# Altium project LDR_Sensor.PrjPcb
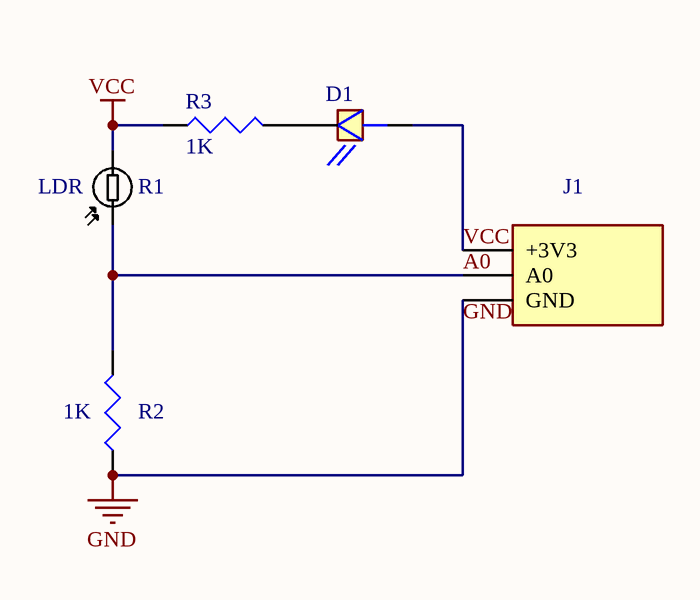
[diagram p0: LDR_Sensor_SCH.SchDoc]
1 sheet, 5 parts. Net scope: global (net labels, ports and power ports of the same name join across sheets).
Board file: LDR_PCB.PcbDoc

## Sheet LDR_Sensor_SCH.SchDoc
size A; SheetNumber: 1; SheetTotal: 1

### Parts
D1  OVLAW4CB7  [LEDRD254W50D305H520P]  (value not drawn)
J1  MTSW-103-07-G-S-140  [PBC03SAAN]  (value not drawn)
R1  LDR  [PDV-P8104]
R2  1K  [CF14JT1K00]
R3  1K  [CF14JT1K00]

### Nets
GND: J1.03(GND) R2.1
VCC: D1.A J1.VCC(+3V3) R1.1 R3.1
A0: J1.02(A0) R1.2 R2.2
NetD1_C: D1.C R3.2

### Library data of the parts
D1 = OVLAW4CB7: Ovlaw4Cb7 White LED 3mm (T-1) Round Lens Through Hole Package | Optek (TT Electronics) OVLAW4CB7; MF: TT Electronics/Optek; SnapEDA_Link: https://www.snapeda.com/parts/OVLAW4CB7/TT+Electronics%252FOptek/view-part/?ref=snap; Package: Package; Value: *; MP: OVLAW4CB7; Check_prices: https://www.snapeda.com/parts/OVLAW4CB7/TT+Electronics%252FOptek/view-part/?ref=eda
R1 = PDV-P8104: CDS PHOTORESISTOR 5MM; Manufacturer: Advanced Photonix; Wavelength: 520nm; Rise Time: 60ms; Value: -60000R; Supplier: Digikey; Supplier Part Number: PDV-P8104-ND; Manufacturer Part Number: PDV-P8104; RoHS: No; Category: Optical Sensors; Stock: 5792; Pricing: 1=0.87, 5=0.762, 10=0.724, 25=0.6772, 50=0.6454, 100=0.6164, 500=0.55816, 1000=0.53652, 5000=0.49297 (USD); Case/Package: Radial; Housing Material: Ceramic; Min Operating Temperature: -30°C; Max Operating Temperature: 75°C; Packaging: Bag; Series: -; Diameter: 5.1mm; Height: 2mm; Lead Free: Lead Free; ComponentLink1URL: https://datasheet.ciiva.com/2819/pdv-p8104-2819548.pdf?src-supplier=Digikey; ComponentLink1Description: https://datasheet.ciiva.com/2819/pdv-p8104-2819548.pdf?src-supplier=Digikey
R2 R3 = CF14JT1K00: RES 1K OHM 5% 1/4W AXIAL; Manufacturer: Stackpole Electronics; Supplier: Digikey; Supplier Part Number: CF14JT1K00CT-ND; Manufacturer Part Number: CF14JT1K00; RoHS: Yes; Category: Through-Hole Resistors; Stock: 677085; Pricing: 1=0.1, 10=0.026, 25=0.022, 50=0.0192, 100=0.0169, 250=0.01424, 500=0.0126, 1000=0.0112 (USD); ComponentLink1URL: http://components.arrow.com/part/dataview/27620077S9848643N1174?src-supplier=Arrow+Electronics; ComponentLink1Description: http://components.arrow.com/part/dataview/27620077S9848643N1174?src-supplier=Arrow+Electronics; ComponentLink2URL: https://www.seielect.com/catalog/SEI-CF_CFM.pdf?src-supplier=Avnet; ComponentLink2Description: https://www.seielect.com/catalog/SEI-CF_CFM.pdf?src-supplier=Avnet; ComponentLink3URL: https://www.seielect.com/catalog/SEI-Packaging.pdf?src-supplier=Digikey; ComponentLink3Description: https://www.seielect.com/catalog/SEI-Packaging.pdf?src-supplier=Digikey; ComponentLink4URL: https://www.seielect.com/Catalog/SEI-CF_CFM.pdf?src-supplier=Digikey; ComponentLink4Description: https://www.seielect.com/Catalog/SEI-CF_CFM.pdf?src-supplier=Digikey; ComponentLink5URL: http://www.seielect.com/Catalog/SEI-CF_CFM.pdf?src-supplier=Future+Electronics; ComponentLink5Description: http://www.seielect.com/Catalog/SEI-CF_CFM.pdf?src-supplier=Future+Electronics; ComponentLink6URL: https://www.verical.com/server-webapp/html/getDatasheet?partID=360403&src-supplier=Verical; ComponentLink6Description: https://www.verical.com/server-webapp/html/getDatasheet?partID=360403&src-supplier=Verical; ComponentLink7URL: https://datasheet.octopart.com/CF14JT1K00-Stackpole-Electronics-datasheet-8360004.pdf?src-supplier=Future+Electronics; ComponentLink7Description: https://datasheet.octopart.com/CF14JT1K00-Stackpole-Electronics-datasheet-8360004.pdf?src-supplier=Future+Electronics; ComponentLink8URL: https://datasheet.octopart.com/CF14JT1K00-Stackpole-Electronics-datasheet-32780772.pdf?src-supplier=Master+Electronics; ComponentLink8Description: https://datasheet.octopart.com/CF14JT1K00-Stackpole-Electronics-datasheet-32780772.pdf?src-supplier=Master+Electronics
J1 = MTSW-103-07-G-S-140: Price: None; Availability: Unavailable; MP: MTSW-103-07-G-S-140; Package: None; Value: *